# EAGLE design controller (EAGLE 9.5.0)

## Sheet 1 of 3
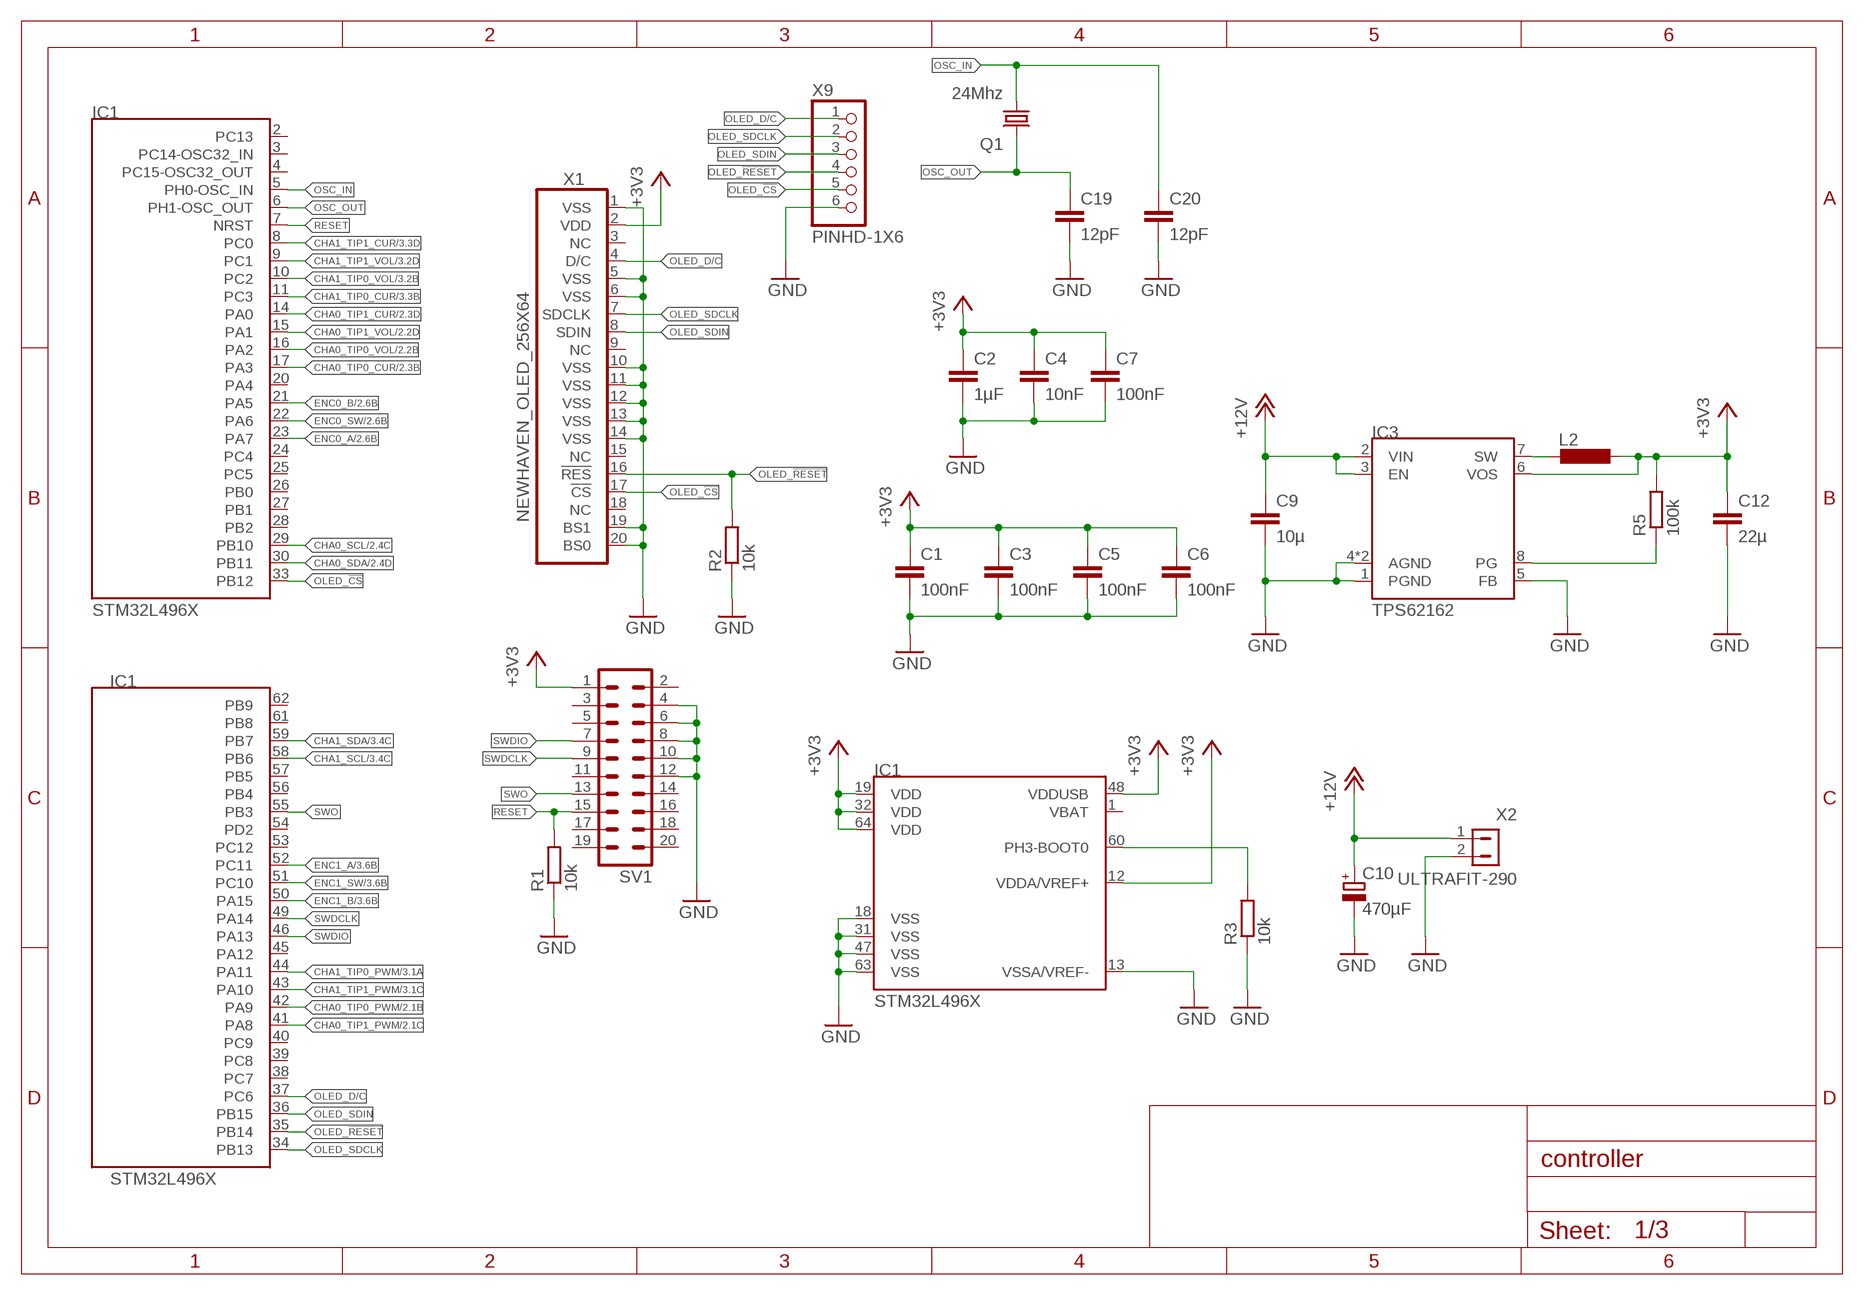
[diagram p0: schematic, sheet 1]

### Parts
C1  100nF  C-EUC0402  [C0402]
C2  1µF  C-EUC0402  [C0402]
C3  100nF  C-EUC0402  [C0402]
C4  10nF  C-EUC0402  [C0402]
C5  100nF  C-EUC0402  [C0402]
C6  100nF  C-EUC0402  [C0402]
C7  100nF  C-EUC0402  [C0402]
C9  10µ  C-EUC0805  [C0805]
C10  470µF  C-EEEFK  [C_EEEFK-10X10]
C12  22µ  C-EUC0805  [C0805]
C19  12pF  C-EUC0603  [C0603]
C20  12pF  C-EUC0603  [C0603]
IC1  STM32L496X  [TQFP64-10X10]
IC3  TPS62162  [WSON8]
L2  VLF3012S  [VLF3012ST]
Q1  24Mhz  XRCHA_F_A  [HCR2520]
R1  10k  R-EU_R0603  [R0603]
R2  10k  R-EU_R0603  [R0603]
R3  10k  R-EU_R0603  [R0603]
R5  100k  R-EU_R0603  [R0603]
SV1  ML20  [ML20]
X1  NEWHAVEN_OLED_256X64  [NEWHAVEN_OLED_256X64]
X2  ULTRAFIT-290  [ULTRAFIT-2-90]
X9  PINHD-1X6  [1X06]

### Nets
3V3_PG: IC3.8(PG) R5.1
3V3_SW: IC3.7(SW) L2.2
+3V3: C1.1 C2.1 C3.1 C4.1 C5.1 C6.1 C7.1 C12.1 IC1.12(VDDA/VREF+) IC1.19(VDD) IC1.32(VDD) IC1.48(VDDUSB) IC1.64(VDD) IC3.6(VOS) L2.1 R5.2 SV1.1 X1.2(VDD) ; also sheet 2,3
+12V: C9.1 C10.+ IC3.2(VIN) IC3.3(EN) X2.1 ; also sheet 2,3
BOOT0: IC1.60(PH3-BOOT0) R3.2
CHA0_SCL: IC1.29(PB10) ; also sheet 2
CHA0_SDA: IC1.30(PB11) ; also sheet 2
CHA0_TIP0_CUR: IC1.17(PA3) ; also sheet 2
CHA0_TIP0_PWM: IC1.42(PA9) ; also sheet 2
CHA0_TIP0_VOL: IC1.16(PA2) ; also sheet 2
CHA0_TIP1_CUR: IC1.14(PA0) ; also sheet 2
CHA0_TIP1_PWM: IC1.41(PA8) ; also sheet 2
CHA0_TIP1_VOL: IC1.15(PA1) ; also sheet 2
CHA1_SCL: IC1.58(PB6) ; also sheet 3
CHA1_SDA: IC1.59(PB7) ; also sheet 3
CHA1_TIP0_CUR: IC1.11(PC3) ; also sheet 3
CHA1_TIP0_PWM: IC1.44(PA11) ; also sheet 3
CHA1_TIP0_VOL: IC1.10(PC2) ; also sheet 3
CHA1_TIP1_CUR: IC1.8(PC0) ; also sheet 3
CHA1_TIP1_PWM: IC1.43(PA10) ; also sheet 3
CHA1_TIP1_VOL: IC1.9(PC1) ; also sheet 3
ENC0_A: IC1.23(PA7) ; also sheet 2
ENC0_B: IC1.21(PA5) ; also sheet 2
ENC0_SW: IC1.22(PA6) ; also sheet 2
ENC1_A: IC1.52(PC11) ; also sheet 3
ENC1_B: IC1.50(PA15) ; also sheet 3
ENC1_SW: IC1.51(PC10) ; also sheet 3
GND: C1.2 C2.2 C3.2 C4.2 C5.2 C6.2 C7.2 C9.2 C10.- C12.2 C19.2 C20.2 IC1.13(VSSA/VREF-) IC1.18(VSS) IC1.31(VSS) IC1.47(VSS) IC1.63(VSS) IC3.1(PGND) IC3.4(AGND) IC3.5(FB) IC3.GND(AGND) R1.1 R2.1 R3.1 SV1.4 SV1.6 SV1.8 SV1.10 SV1.12 X1.1(VSS) X1.5(VSS) X1.6(VSS) X1.10(VSS) X1.11(VSS) X1.12(VSS) X1.13(VSS) X1.14(VSS) X1.19(BS1) X1.20(BS0) X2.2 X9.6 ; also sheet 2,3
OLED_!CS: IC1.33(PB12) X1.17(!CS) X9.5
OLED_!RESET: IC1.35(PB14) R2.2 X1.16(!RES) X9.4
OLED_D/C: IC1.37(PC6) X1.4(D/C) X9.1
OLED_SDCLK: IC1.34(PB13) X1.7(SDCLK) X9.2
OLED_SDIN: IC1.36(PB15) X1.8(SDIN) X9.3
OSC_IN: C20.1 IC1.5(PH0-OSC_IN) Q1.1
OSC_OUT: C19.1 IC1.6(PH1-OSC_OUT) Q1.2
RESET: IC1.7(NRST) R1.2 SV1.15
SWDCLK: IC1.49(PA14) SV1.9
SWDIO: IC1.46(PA13) SV1.7
SWO: IC1.55(PB3) SV1.13
Unconnected: IC1.1(VBAT) IC1.2(PC13) IC1.3(PC14-OSC32_IN) IC1.4(PC15-OSC32_OUT) IC1.20(PA4) IC1.24(PC4) IC1.25(PC5) IC1.26(PB0) IC1.27(PB1) IC1.28(PB2) IC1.38(PC7) IC1.39(PC8) IC1.40(PC9) IC1.45(PA12) IC1.53(PC12) IC1.54(PD2) IC1.56(PB4) IC1.57(PB5) IC1.61(PB8) IC1.62(PB9) SV1.2 SV1.3 SV1.5 SV1.11 SV1.14 SV1.16 SV1.17 SV1.18 SV1.19 SV1.20 X1.3(NC) X1.9(NC) X1.15(NC) X1.18(NC)

## Sheet 2 of 3
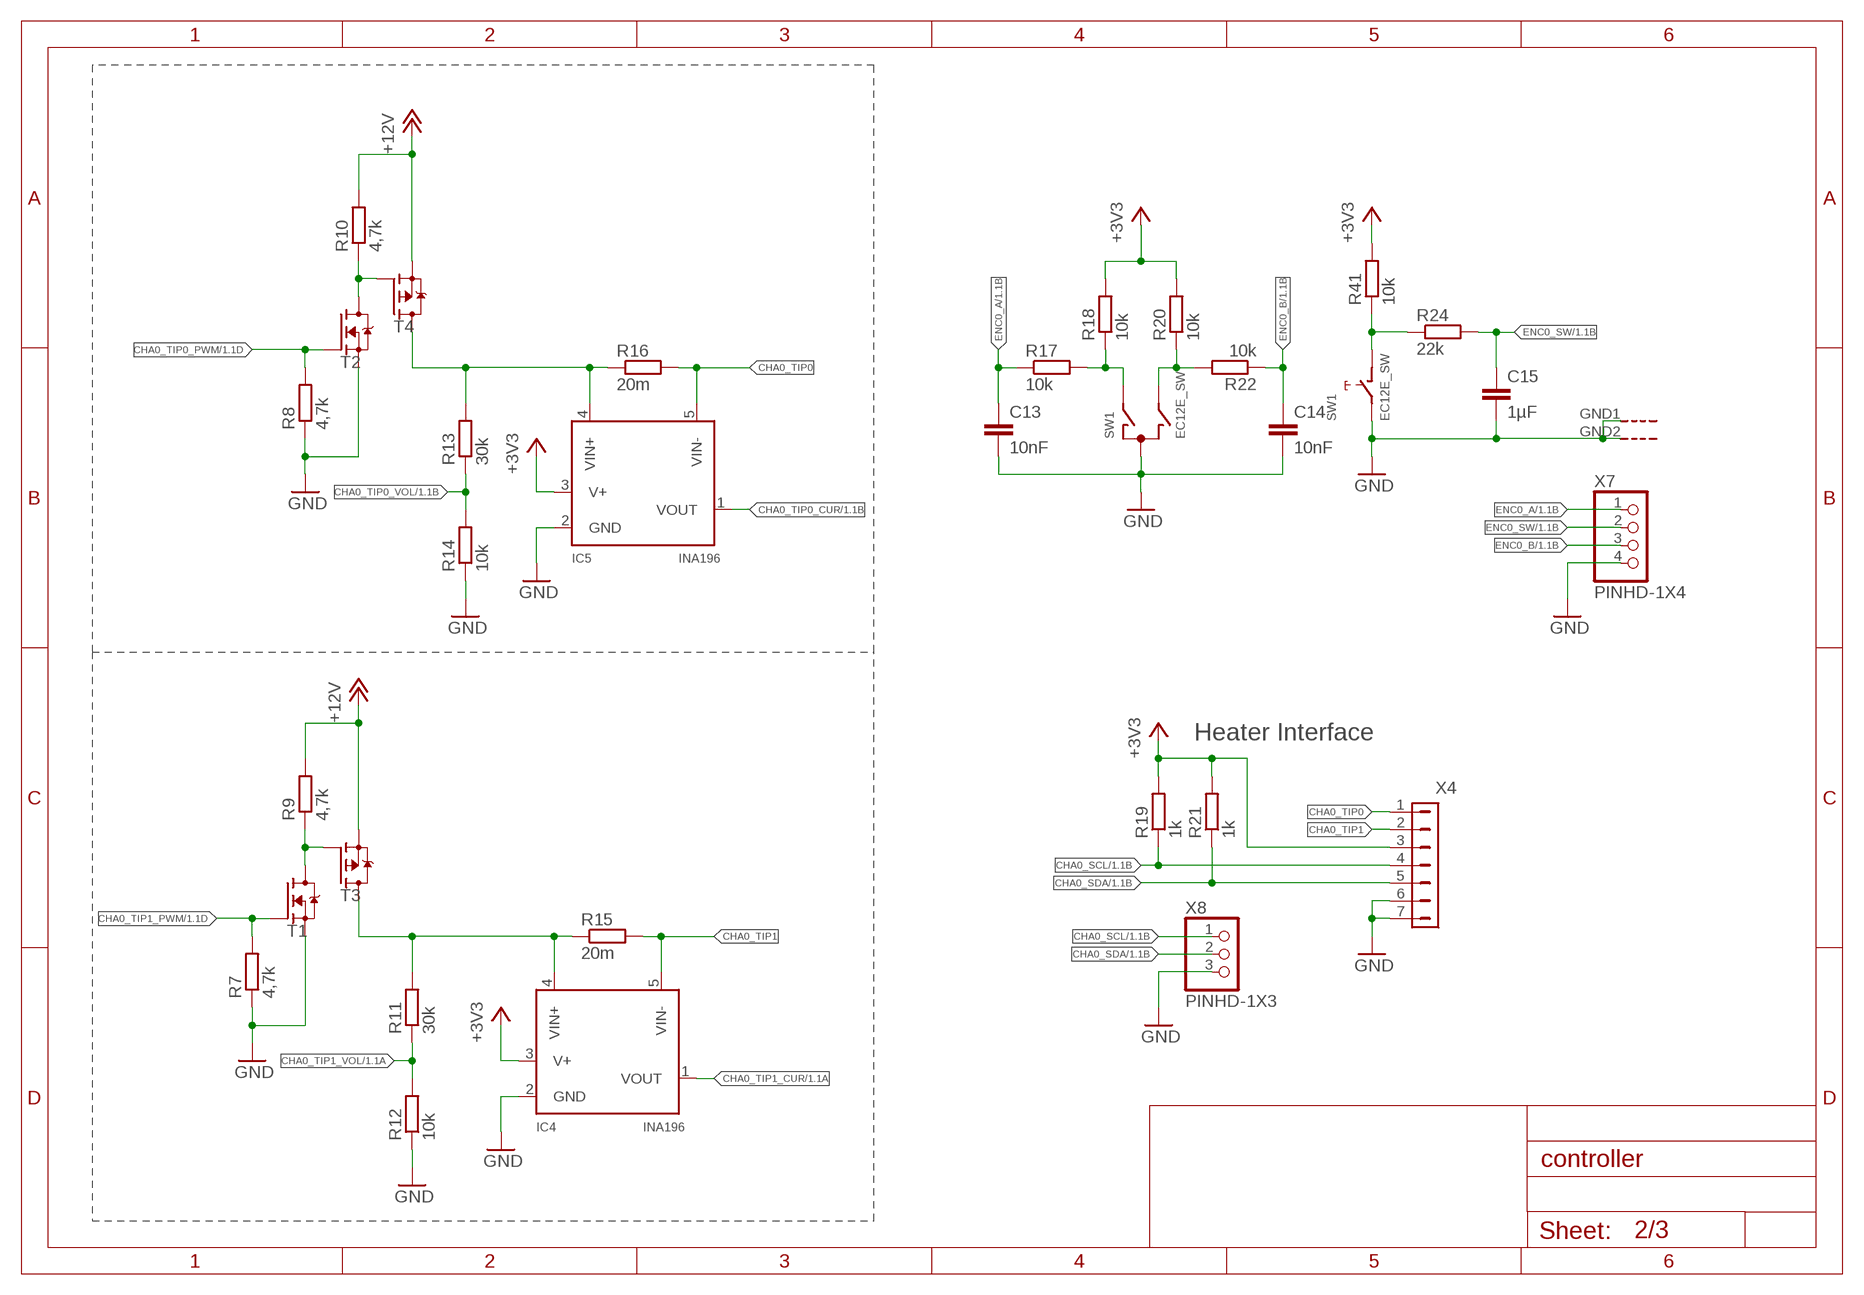
[diagram p1: schematic, sheet 2]

### Parts
C13  10nF  C-EUC0805  [C0805]
C14  10nF  C-EUC0805  [C0805]
C15  1µF  C-EUC0805  [C0805]
IC4  INA196  [SOT23-5L]
IC5  INA196  [SOT23-5L]
R7  4,7k  R-EU_R0805  [R0805]
R8  4,7k  R-EU_R0805  [R0805]
R9  4,7k  R-EU_R0805  [R0805]
R10  4,7k  R-EU_R0805  [R0805]
R11  30k  R-EU_R0603  [R0603]
R12  10k  R-EU_R0603  [R0603]
R13  30k  R-EU_R0603  [R0603]
R14  10k  R-EU_R0603  [R0603]
R15  20m  R-EU_R2010  [R2010]
R16  20m  R-EU_R2010  [R2010]
R17  10k  R-EU_R0805  [R0805]
R18  10k  R-EU_R0805  [R0805]
R19  1k  R-EU_R0603  [R0603]
R20  10k  R-EU_R0805  [R0805]
R21  1k  R-EU_R0603  [R0603]
R22  10k  R-EU_R0805  [R0805]
R24  22k  R-EU_R0805  [R0805]
R41  10k  R-EU_R0805  [R0805]
SW1  EC12E_SW  [ALPS_EC12E_SW]
T1  NVR4003NT3G  [SOT23]
T2  NVR4003NT3G  [SOT23]
T3  IRF7416  [SO8]
T4  IRF7416  [SO8]
X4  NANOFIT-7  [NANOFIT-7]
X7  PINHD-1X4  [1X04]
X8  PINHD-1X3  [1X03]

### Nets
+3V3: IC4.3(V+) IC5.3(V+) R18.2 R19.2 R20.2 R21.2 R41.2 X4.3 ; also sheet 1,3
+12V: R9.2 R10.2 T3.1(S) T3.2(S) T3.3(S) T4.1(S) T4.2(S) T4.3(S) ; also sheet 1,3
CHA0_SCL: R19.1 X4.4 X8.1 ; also sheet 1
CHA0_SDA: R21.1 X4.5 X8.2 ; also sheet 1
CHA0_TIP0: IC5.5(VIN-) R16.2 X4.1
CHA0_TIP0_CUR: IC5.1(VOUT) ; also sheet 1
CHA0_TIP0_PWM: R8.2 T2.1(G) ; also sheet 1
CHA0_TIP0_PWM_D: R10.1 T2.3(D) T4.4(G)
CHA0_TIP0_SEN: IC5.4(VIN+) R13.2 R16.1 T4.5(D) T4.6(D) T4.7(D) T4.8(D)
CHA0_TIP0_VOL: R13.1 R14.2 ; also sheet 1
CHA0_TIP1: IC4.5(VIN-) R15.2 X4.2
CHA0_TIP1_CUR: IC4.1(VOUT) ; also sheet 1
CHA0_TIP1_PWM: R7.2 T1.1(G) ; also sheet 1
CHA0_TIP1_PWM_D: R9.1 T1.3(D) T3.4(G)
CHA0_TIP1_SEN: IC4.4(VIN+) R11.2 R15.1 T3.5(D) T3.6(D) T3.7(D) T3.8(D)
CHA0_TIP1_VOL: R11.1 R12.2 ; also sheet 1
ENC0_A: C13.1 R17.1 X7.1 ; also sheet 1
ENC0_A_UNFIL: R17.2 R18.1 SW1.A
ENC0_B: C14.1 R22.1 X7.3 ; also sheet 1
ENC0_B_UNFIL: R20.1 R22.2 SW1.B
ENC0_SW: C15.1 R24.2 X7.2 ; also sheet 1
ENC0_SW_R: R24.1 R41.1 SW1.D
GND: C13.2 C14.2 C15.2 IC4.2(GND) IC5.2(GND) R7.1 R8.1 R12.1 R14.1 SW1.C SW1.E SW1.GND1(G) SW1.GND2(G) T1.2(S) T2.2(S) X4.6 X4.7 X7.4 X8.3 ; also sheet 1,3

### Notes on the sheet
- Heater Interface

## Sheet 3 of 3
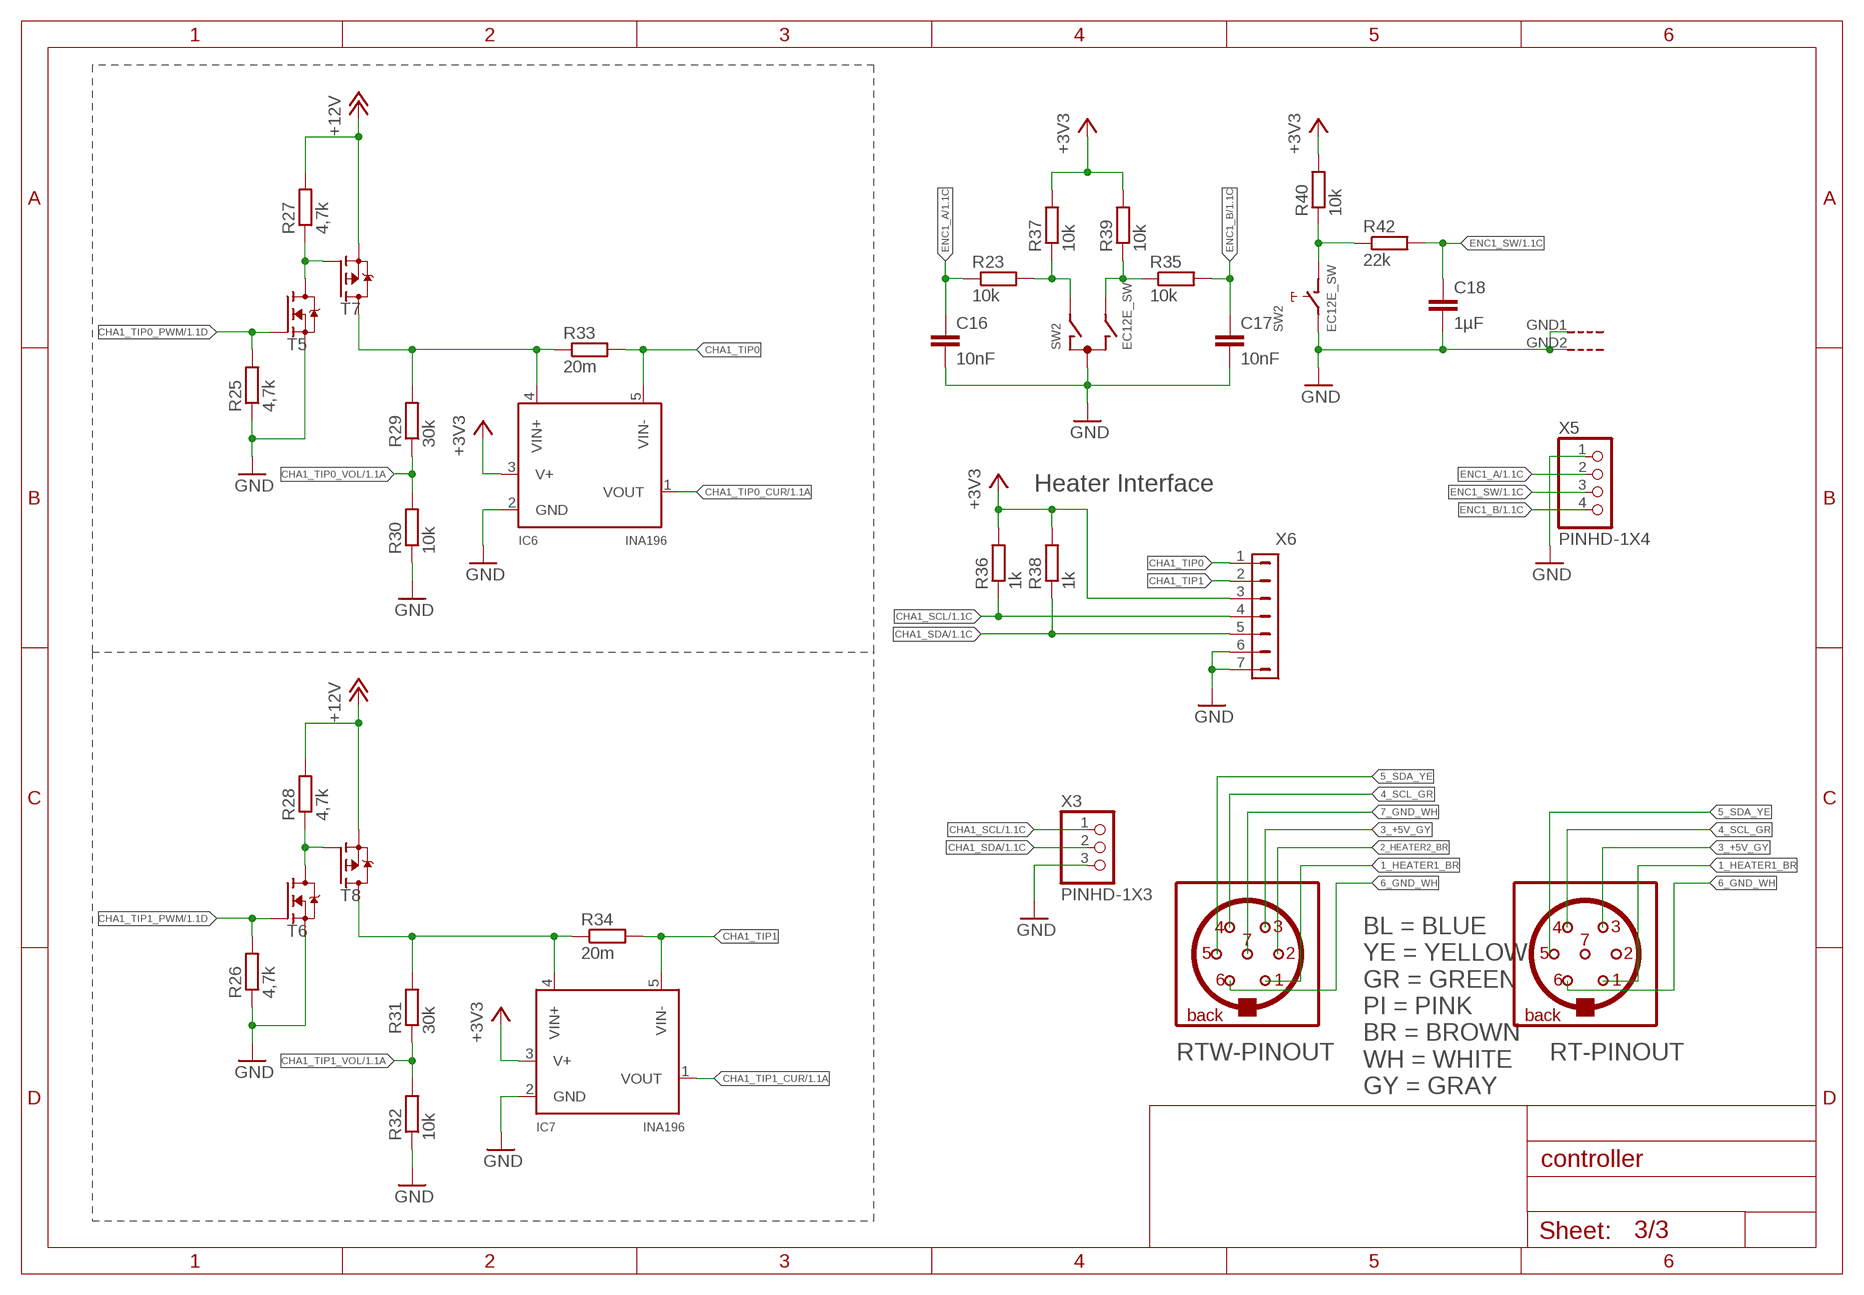
[diagram p2: schematic, sheet 3]

### Parts
C16  10nF  C-EUC0805  [C0805]
C17  10nF  C-EUC0805  [C0805]
C18  1µF  C-EUC0805  [C0805]
CON1  BINDER-IP40  (no package)
CON2  BINDER-IP40  (no package)
IC6  INA196  [SOT23-5L]
IC7  INA196  [SOT23-5L]
R23  10k  R-EU_R0805  [R0805]
R25  4,7k  R-EU_R0805  [R0805]
R26  4,7k  R-EU_R0805  [R0805]
R27  4,7k  R-EU_R0805  [R0805]
R28  4,7k  R-EU_R0805  [R0805]
R29  30k  R-EU_R0603  [R0603]
R30  10k  R-EU_R0603  [R0603]
R31  30k  R-EU_R0603  [R0603]
R32  10k  R-EU_R0603  [R0603]
R33  20m  R-EU_R2010  [R2010]
R34  20m  R-EU_R2010  [R2010]
R35  10k  R-EU_R0805  [R0805]
R36  1k  R-EU_R0603  [R0603]
R37  10k  R-EU_R0805  [R0805]
R38  1k  R-EU_R0603  [R0603]
R39  10k  R-EU_R0805  [R0805]
R40  10k  R-EU_R0805  [R0805]
R42  22k  R-EU_R0805  [R0805]
SW2  EC12E_SW  [ALPS_EC12E_SW]
T5  NVR4003NT3G  [SOT23]
T6  NVR4003NT3G  [SOT23]
T7  IRF7416  [SO8]
T8  IRF7416  [SO8]
X3  PINHD-1X3  [1X03]
X5  PINHD-1X4  [1X04]
X6  NANOFIT-7  [NANOFIT-7]

### Nets
1_HEATER1_BR: CON1.P$4 CON2.P$4
2_HEATER2_BR: CON1.P$2
3_+5V_GY: CON1.P$3 CON2.P$3
4_SCL_GR: CON1.P$6 CON2.P$6
5_SDA_YE: CON1.P$7
6_GND_WH: CON1.P$5 CON2.P$5
7_GND_WH: CON1.P$1
+3V3: IC6.3(V+) IC7.3(V+) R36.2 R37.2 R38.2 R39.2 R40.2 X6.3 ; also sheet 1,2
+12V: R27.2 R28.2 T7.1(S) T7.2(S) T7.3(S) T8.1(S) T8.2(S) T8.3(S) ; also sheet 1,2
CHA1_SCL: R36.1 X3.1 X6.4 ; also sheet 1
CHA1_SDA: R38.1 X3.2 X6.5 ; also sheet 1
CHA1_TIP0: IC6.5(VIN-) R33.2 X6.1
CHA1_TIP0_CUR: IC6.1(VOUT) ; also sheet 1
CHA1_TIP0_PWM: R25.2 T5.1(G) ; also sheet 1
CHA1_TIP0_PWM_D: R27.1 T5.3(D) T7.4(G)
CHA1_TIP0_SEN: IC6.4(VIN+) R29.2 R33.1 T7.5(D) T7.6(D) T7.7(D) T7.8(D)
CHA1_TIP0_VOL: R29.1 R30.2 ; also sheet 1
CHA1_TIP1: IC7.5(VIN-) R34.2 X6.2
CHA1_TIP1_CUR: IC7.1(VOUT) ; also sheet 1
CHA1_TIP1_PWM: R26.2 T6.1(G) ; also sheet 1
CHA1_TIP1_PWM_D: R28.1 T6.3(D) T8.4(G)
CHA1_TIP1_SEN: IC7.4(VIN+) R31.2 R34.1 T8.5(D) T8.6(D) T8.7(D) T8.8(D)
CHA1_TIP1_VOL: R31.1 R32.2 ; also sheet 1
ENC1_A: C16.1 R23.1 X5.2 ; also sheet 1
ENC1_A_UNFIL: R23.2 R37.1 SW2.A
ENC1_B: C17.1 R35.2 X5.4 ; also sheet 1
ENC1_B_UNFIL: R35.1 R39.1 SW2.B
ENC1_SW: C18.1 R42.2 X5.3 ; also sheet 1
ENC1_SW_R: R40.1 R42.1 SW2.D
GND: C16.2 C17.2 C18.2 IC6.2(GND) IC7.2(GND) R25.1 R26.1 R30.1 R32.1 SW2.C SW2.E SW2.GND1(G) SW2.GND2(G) T5.2(S) T6.2(S) X3.3 X5.1 X6.6 X6.7 ; also sheet 1,2
Unconnected: CON2.P$1 CON2.P$2 CON2.P$7

### Notes on the sheet
- Heater Interface
- BL = BLUE
  YE = YELLOW
  GR = GREEN
  PI = PINK
  BR = BROWN
  WH = WHITE
  GY = GRAY
- RTW-PINOUT | RT-PINOUT

## Library data of the parts
C1 C3 C5-C7 = rcl:C-EU: CAPACITOR, European symbol; OC_DIGIKEY: 1276-1001-1-ND; SPICEPREFIX: C
C2 = rcl:C-EU: CAPACITOR, European symbol; OC_DIGIKEY: 1276-1067-1-ND; SPICEPREFIX: C
C4 = rcl:C-EU: CAPACITOR, European symbol; OC_DIGIKEY: 311-1042-1-ND; SPICEPREFIX: C
C9 = rcl:C-EU: CAPACITOR, European symbol; OC_DIGIKEY: 1276-2890-1-ND; SPICEPREFIX: C
C10 = solderpi:C-EEEFK; OC_DIGIKEY: PCE3805CT-ND
C12 = rcl:C-EU: CAPACITOR, European symbol; OC_DIGIKEY: 1276-6526-1-ND; SPICEPREFIX: C
C13 C14 C16 C17 = rcl:C-EU: CAPACITOR, European symbol; OC_DIGIKEY: 732-8061-1-ND; SPICEPREFIX: C
C15 C18 = rcl:C-EU: CAPACITOR, European symbol; OC_DIGIKEY: 399-8008-1-ND; SPICEPREFIX: C
C19 C20 = rcl:C-EU: CAPACITOR, European symbol; OC_DIGIKEY: 478-11444-1-ND; SPICEPREFIX: C
CON1 CON2 = solderpi:BINDER-IP40
IC1 = solderpi:STM32L496X; OC_DIGIKEY: 497-17173-ND
IC3 = solderpi:TPS62162; OC_DIGIKEY: 296-29897-1-ND
IC4-IC7 = solderpi:INA196; OC_DIGIKEY: 296-17166-1-ND
L2 = solderpi:VLF3012S; OC_DIGIKEY: 445-4200-1-ND
Q1 = solderpi:XRCHA_F_A; OC_DIGIKEY: 490-9652-1-ND
R1-R3 R12 R14 R30 R32 = rcl:R-EU_: RESISTOR, European symbol; OC_DIGIKEY: RMCF0603FT10K0CT-ND; SPICEPREFIX: R
R5 = rcl:R-EU_: RESISTOR, European symbol; OC_DIGIKEY: RMCF0603FT100KCT-ND; SPICEPREFIX: R
R7-R10 R25-R28 = rcl:R-EU_: RESISTOR, European symbol; OC_DIGIKEY: CR0805-FX-4701GLFTR-ND; SPICEPREFIX: R
R11 R13 R29 R31 = rcl:R-EU_: RESISTOR, European symbol; OC_DIGIKEY: RMCF0603FT30K0CT-ND; SPICEPREFIX: R
R15 R16 R33 R34 = rcl:R-EU_: RESISTOR, European symbol; OC_DIGIKEY: 541-10266-1-ND; SPICEPREFIX: R
R17 R18 R20 R22 R23 R35 R37 R39-R41 = rcl:R-EU_: RESISTOR, European symbol; OC_DIGIKEY: 311-10.0KCRCT-ND; SPICEPREFIX: R
R19 R21 R36 R38 = rcl:R-EU_: RESISTOR, European symbol; OC_DIGIKEY: RMCF0603FT1K00CT-ND; SPICEPREFIX: R
R24 R42 = rcl:R-EU_: RESISTOR, European symbol; OC_DIGIKEY: 311-22.0KCRCT-ND; SPICEPREFIX: R
SV1 = solderpi:ML20: HARTING; OC_DIGIKEY: S9172-ND; OC_FARNELL: unknown; OC_NEWARK: unknown
SW1 SW2 = switch-alps:EC12E_SW: ALPS rotary Encoder EC12E series with switch; MPN: EC12E2424407; OC_FARNELL: 1520813; OC_NEWARK: 74M1068
T1 T2 T5 T6 = solderpi:NVR4003NT3G; OC_DIGIKEY: NVR4003NT3GOSCT-ND
T3 T4 T7 T8 = solderpi:IRF7416; OC_DIGIKEY: IRF7416TRPBFCT-ND
X1 = solderpi:NEWHAVEN_OLED_256X64: PIN HEADER; OC_DIGIKEY: SAM1093-20-ND
X2 = solderpi:ULTRAFIT-2; OC_DIGIKEY: WM11586-ND
X3 X8 = solderpi:PINHD-1X3: PIN HEADER; OC_DIGIKEY: 1849-1003-ND
X4 X6 = solderpi:NANOFIT-7; OC_DIGIKEY: WM16898-ND
X5 X7 = solderpi:PINHD-1X4: PIN HEADER; OC_DIGIKEY: 2057-PH1-04-UA-ND
X9 = solderpi:PINHD-1X6: PIN HEADER; OC_DIGIKEY: 1849-1001-ND

## Net classes
0 default: width 0.2 mm, drill 0.3 mm, clearance 0.2 mm

## Board
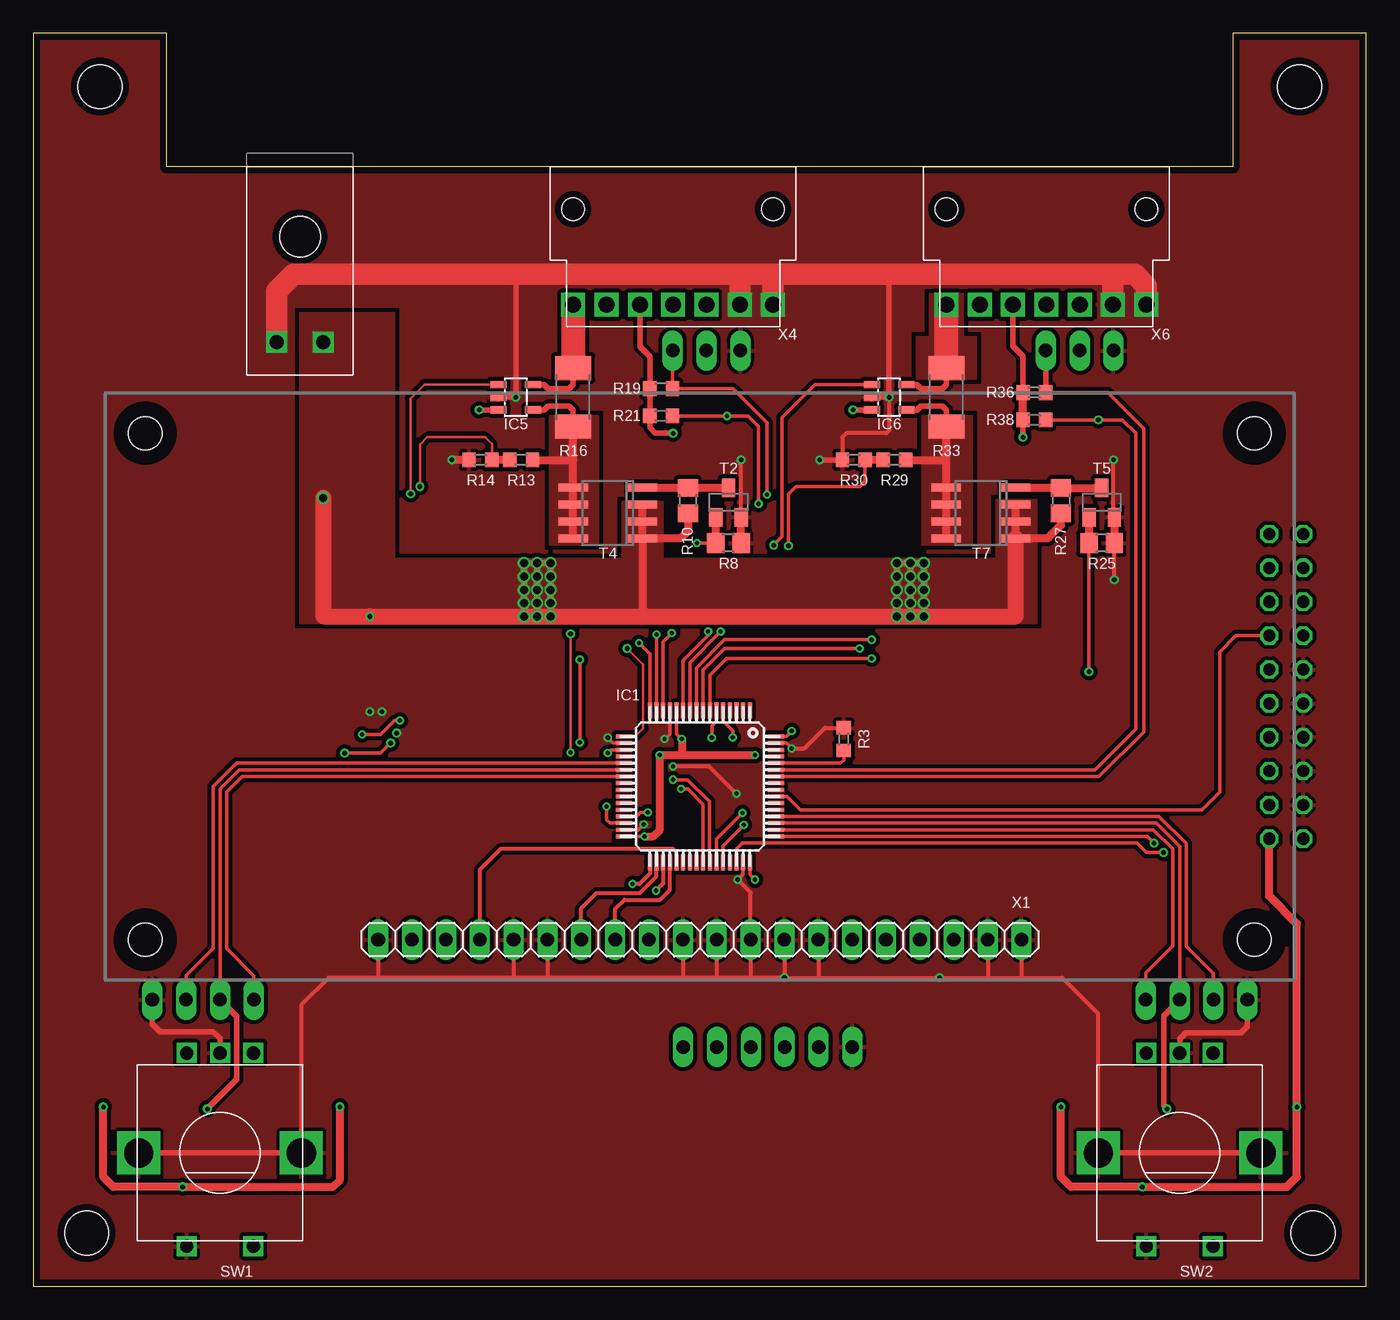
[diagram p3: board, top side]
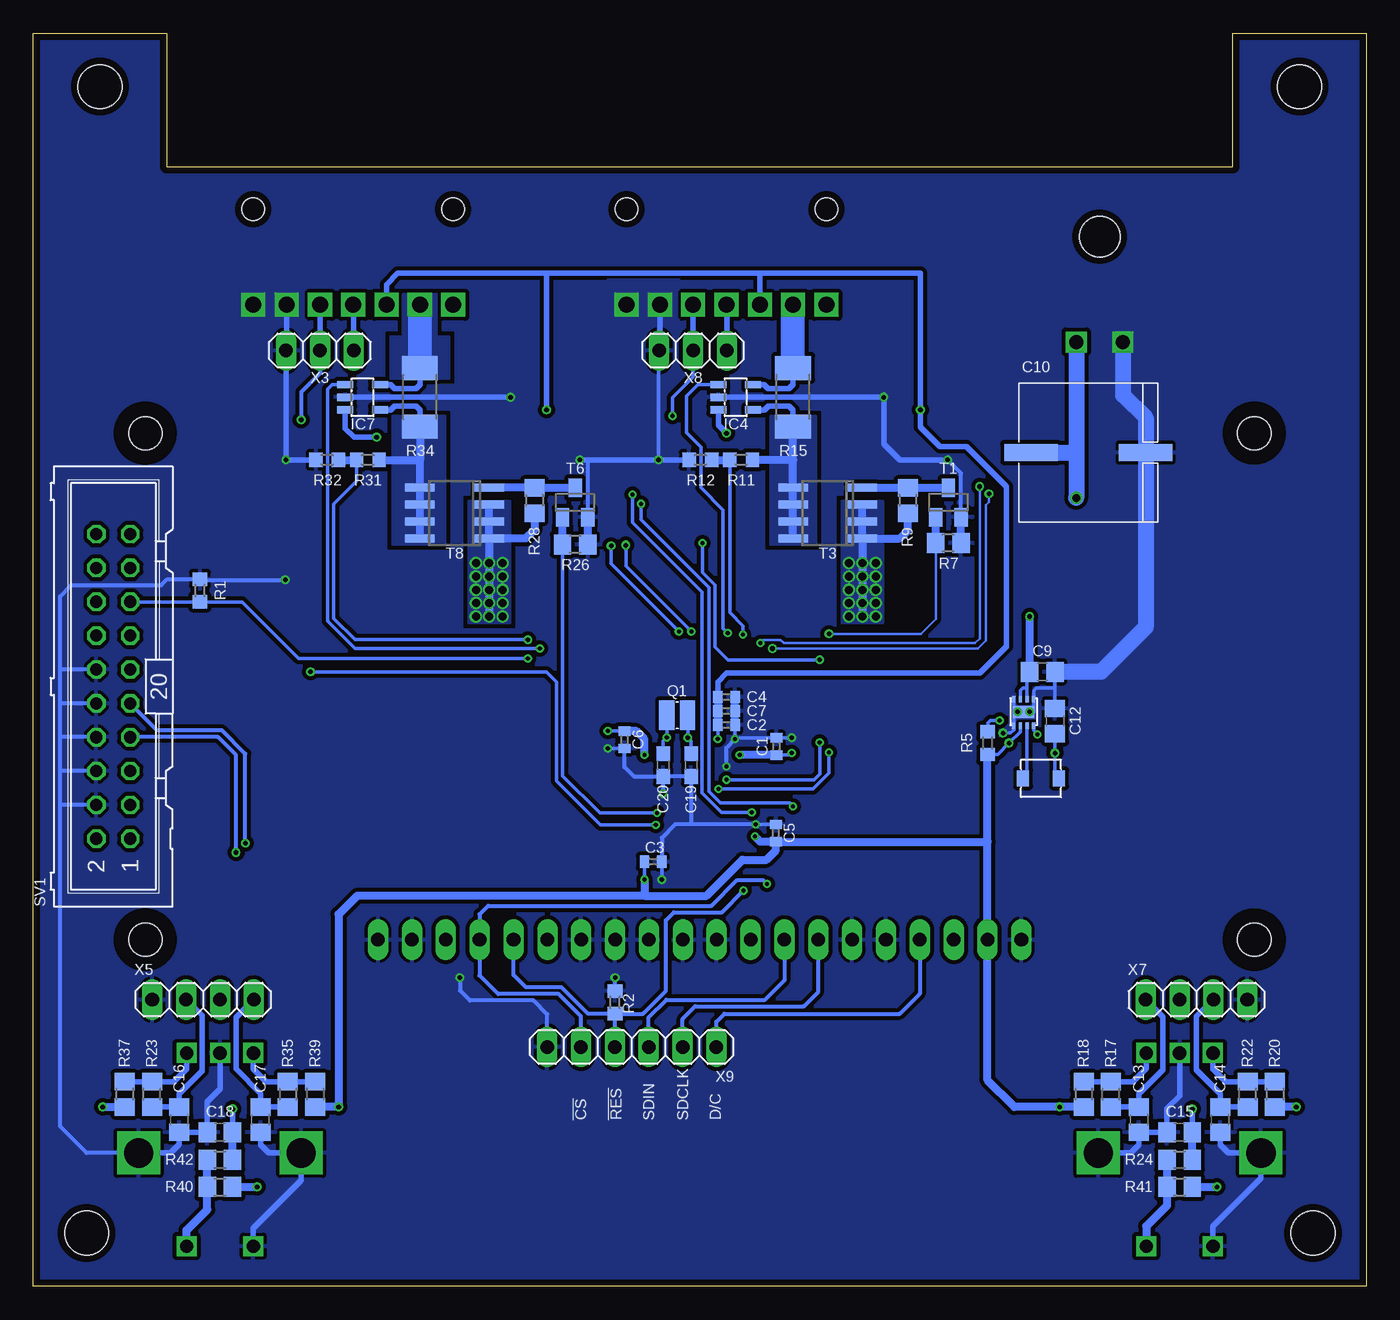
[diagram p4: board, bottom side, seen from below]

Size 100 x 94 mm. Coordinates in mm from the lower left corner, seen from the top.
Outline: 0,0 100,0 100,94 90,94 90,84 10,84 10,94 0,94 0,0
Copper layers (1*16): Top 0.035mm / dielectric 1.6mm / Bottom 0.035mm
Design rules "Elecrow_2-layer_PCB_eagle_rule": minimum track width 6mil, minimum drill 12mil, track to track 6mil, track to pad 6mil, pad to pad 6mil, via to via 8mil, smd to smd 0mil, copper to edge 20mil, drill to drill 10mil, minimum pad ring 6mil, minimum via ring 6mil, stop-mask expansion 0mil, vias tented up to drill 100mil, thermal gap 10mil
Holes 3.3 mm at 4,4 96,4 95,90 5,90

### Footprints (pad centres in the part's own frame; a part is rotated, then mirrored left to right if it is on the bottom)
C0402 = smd 0.7 x 0.9: 1 -0.65,0; 2 0.65,0
C0805 = smd 1.3 x 1.5: 1 -0.95,0; 2 0.95,0
C_EEEFK-10X10 = smd 4 x 1.3: + -4.3,0; - 4.3,0
C0603 = smd 1.1 x 1: 1 -0.85,0; 2 0.85,0
TQFP64-10X10 = smd 1.2 x 0.3: 1 -5.7,3.75; 2 -5.7,3.25; 3 -5.7,2.75; 4 -5.7,2.25; 5 -5.7,1.75; 6 -5.7,1.25; 7 -5.7,0.75; 8 -5.7,0.25; 9 -5.7,-0.25; 10 -5.7,-0.75; 11 -5.7,-1.25; 12 -5.7,-1.75; 13 -5.7,-2.25; 14 -5.7,-2.75; 15 -5.7,-3.25; 16 -5.7,-3.75; 33 5.7,-3.75; 34 5.7,-3.25; 35 5.7,-2.75; 36 5.7,-2.25; 37 5.7,-1.75; 38 5.7,-1.25; 39 5.7,-0.75; 40 5.7,-0.25; 41 5.7,0.25; 42 5.7,0.75; 43 5.7,1.25; 44 5.7,1.75; 45 5.7,2.25; 46 5.7,2.75; 47 5.7,3.25; 48 5.7,3.75 | smd 0.3 x 1.2: 17 -3.75,-5.7; 18 -3.25,-5.7; 19 -2.75,-5.7; 20 -2.25,-5.7; 21 -1.75,-5.7; 22 -1.25,-5.7; 23 -0.75,-5.7; 24 -0.25,-5.7; 25 0.25,-5.7; 26 0.75,-5.7; 27 1.25,-5.7; 28 1.75,-5.7; 29 2.25,-5.7; 30 2.75,-5.7; 31 3.25,-5.7; 32 3.75,-5.7; 49 3.75,5.7; 50 3.25,5.7; 51 2.75,5.7; 52 2.25,5.7; 53 1.75,5.7; 54 1.25,5.7; 55 0.75,5.7; 56 0.25,5.7; 57 -0.25,5.7; 58 -0.75,5.7; 59 -1.25,5.7; 60 -1.75,5.7; 61 -2.25,5.7; 62 -2.75,5.7; 63 -3.25,5.7; 64 -3.75,5.7
WSON8 = smd 0.5 x 0.25: 1 -0.95,0.75; 2 -0.95,0.25; 3 -0.95,-0.25; 4 -0.95,-0.75; 5 1.05,-0.75; 6 1.05,-0.25; 7 1.05,0.25; 8 1.05,0.75 | smd 0.9 x 1.6: GND 0,0
SOT23-5L = smd 0.55 x 1.2: 1 -0.95,-1.3; 2 0,-1.3; 3 0.95,-1.3; 4 0.95,1.3; 5 -0.95,1.3
VLF3012ST = smd 0.9 x 1.2: 1 -1.35,0; 2 1.35,0
HCR2520 = smd 1.15 x 2.2: 1 -0.775,0; 2 0.775,0
R0603 = smd 1 x 1.1: 1 -0.85,0; 2 0.85,0
R0805 = smd 1.3 x 1.5: 1 -0.95,0; 2 0.95,0
R2010 = smd 1.8 x 2.7: 1 -2.2,0; 2 2.2,0
ML20 = drill 0.914 octagon: 1 -11.43,-1.27; 2 -11.43,1.27; 3 -8.89,-1.27; 4 -8.89,1.27; 5 -6.35,-1.27; 6 -6.35,1.27; 7 -3.81,-1.27; 8 -3.81,1.27; 9 -1.27,-1.27; 10 -1.27,1.27; 11 1.27,-1.27; 12 1.27,1.27; 13 3.81,-1.27; 14 3.81,1.27; 15 6.35,-1.27; 16 6.35,1.27; 17 8.89,-1.27; 18 8.89,1.27; 19 11.43,-1.27; 20 11.43,1.27
ALPS_EC12E_SW = drill 1 square: A -2.5,-7.5; B 2.5,-7.5; C 0,-7.5; D -2.5,7; E 2.5,7 | drill 2.2 square: GND1 -6.1,0; GND2 6.1,0
SOT23 = smd 1 x 1.4: 1 -0.95,-1.1; 2 0.95,-1.1; 3 0,1.1
SO8 = smd 0.6 x 2.2: 1 -1.905,-2.6; 2 -0.635,-2.6; 3 0.635,-2.6; 4 1.905,-2.6; 5 1.905,2.6; 6 0.635,2.6; 7 -0.635,2.6; 8 -1.905,2.6
NEWHAVEN_OLED_256X64 = drill 1.016 long: 1 24.13,19; 2 21.59,19; 3 19.05,19; 4 16.51,19; 5 13.97,19; 6 11.43,19; 7 8.89,19; 8 6.35,19; 9 3.81,19; 10 1.27,19; 11 -1.27,19; 12 -3.81,19; 13 -6.35,19; 14 -8.89,19; 15 -11.43,19; 16 -13.97,19; 17 -16.52,19; 18 -19.06,19; 19 -21.6,19; 20 -24.14,19 | hole 2.5: -41.6,-19; 41.6,-19; -41.6,19; 41.6,19
ULTRAFIT-2-90 = drill 1.05 square: 1 -1.75,13.16; 2 1.75,13.15 | hole 3.05: 0,5.25
1X03 = drill 1.016 long: 1 -2.54,0; 2 0,0; 3 2.54,0
NANOFIT-7 = drill 1.2 square: 1 7.5,10.37; 2 5,10.37; 3 2.5,10.37; 4 0,10.37; 5 -2.5,10.37; 6 -5,10.37; 7 -7.5,10.37 | hole 1.7: -7.5,3.2; 7.5,3.2
1X04 = drill 1.016 long: 1 -3.81,0; 2 -1.27,0; 3 1.27,0; 4 3.81,0
1X06 = drill 1.016 long: 1 -6.35,0; 2 -3.81,0; 3 -1.27,0; 4 1.27,0; 5 3.81,0; 6 6.35,0

### Placement (x,y rotation side)
C1  44.25,40.5 90 bottom
C2  48,42.1 0 bottom
C3  53.5,31.85 0 bottom
C4  48,44.2 0 bottom
C5  44.3,34 90 bottom
C6  55.65,41 270 bottom
C7  48,43.15 0 bottom
C9  24.3,46.1 0 bottom
C10  20.85,62.55 0 bottom
C12  23.35,42.4 90 bottom
C13  17.05,12.5 270 bottom
C14  10.95,12.5 270 bottom
C15  14,11.55 180 bottom
C16  89.05,12.5 270 bottom
C17  82.95,12.5 270 bottom
C18  86,11.55 180 bottom
C19  50.65,39.1 270 bottom
C20  52.75,39.1 270 bottom
IC1  50,37.5 270 top
IC3  25.7,43.1 270 bottom
IC4  47.3,66.7 270 bottom
IC5  36.2,66.7 270 top
IC6  64.2,66.7 270 top
IC7  75.3,66.7 270 bottom
L2  24.4,38.1 180 bottom
Q1  51.7,42.85 0 bottom
R1  87.5,52.2 270 bottom
R2  56.36,21.3 270 bottom
R3  60.8,41.05 270 top
R5  28.4,40.75 270 bottom
R7  31.35,55.75 180 bottom
R8  52.15,55.75 180 top
R9  34.4,58.95 270 bottom
R10  49.1,58.95 270 top
R11  46.9,62 0 bottom
R12  49.95,62 0 bottom
R13  36.6,62 0 top
R14  33.55,62 0 top
R15  43,66.7 90 bottom
R16  40.5,66.7 90 top
R17  19.15,14.4 90 bottom
R18  21.2,14.4 270 bottom
R19  47.1,67.35 180 top
R20  6.85,14.4 270 bottom
R21  47.1,65.3 180 top
R22  8.9,14.4 90 bottom
R23  91.1,14.4 90 bottom
R24  14,9.5 0 bottom
R25  80.15,55.75 180 top
R26  59.35,55.65 180 bottom
R27  77.1,58.95 270 top
R28  62.4,58.95 270 bottom
R29  64.6,62 0 top
R30  61.55,62 0 top
R31  74.9,62 0 bottom
R32  77.95,62 0 bottom
R33  68.5,66.7 90 top
R34  71,66.7 90 bottom
R35  80.9,14.4 270 bottom
R36  75.1,67.05 180 top
R37  93.15,14.4 270 bottom
R38  75.1,65 180 top
R39  78.85,14.4 270 bottom
R40  86,7.45 0 bottom
R41  14,7.45 0 bottom
R42  86,9.5 0 bottom
SV1  94,45 90 bottom
SW1  14,10 180 top
SW2  86,10 180 top
T1  31.35,58.8 0 bottom
T2  52.15,58.8 0 top
T3  40.4,58 90 bottom
T4  43.1,58 90 top
T5  80.15,58.8 0 top
T6  59.35,58.8 0 bottom
T7  71.1,58 90 top
T8  68.4,58 90 bottom
X1  50,45 180 top
X2  20,84 180 top
X3  78.5,70.2 180 bottom
X4  48,84 180 top
X5  87.27,21.5 0 bottom
X6  76,84 180 top
X7  12.73,21.5 0 bottom
X8  50.5,70.2 180 bottom
X9  55.1,17.95 180 bottom

### Tracks (layer width: path | path; a pad name or v marks a point on that pad's centre or on a via)
3V3_PG  (via drill 0.3)
  Top 0.25: v27.5,42.45 27.1,42.45 26.05,41.4 v24.66,41.4
  Bottom 0.25: R5.1 28.4,42.25 28.2,42.45 v27.5,42.45 | IC3.8 24.95,41.69 v24.66,41.4
3V3_SW
  Bottom 0.2: L2.2 25.45,38.4
  Bottom 0.25: 25.45,38.4 IC3.7
+3V3  (via drill 0.3, 0.35)
  Top 0.25: v26.8,40.75 26.05,40 v23.35,40 | IC1.48 53.75,30.9 v54.15,30.5 | IC1.64 56.5,41.25 v56.9,41.65 | IC1.19 43.35,40.25 v43.1,40 | v45.85,33.75 IC1.32 | IC1.12 48.25,41.45 v48.65,41.05
  Top 0.4: IC5.3 v33.45,65.75 | X4.3 45.5,70.5 46.25,69.75 R19.2 R21.2 46.25,64.4 46.65,64 v48,64 | R36.2 74.25,69.8 73.5,70.55 X6.3 | IC6.3 v61.5,65.75 | R38.2 v74.25,63.7
  Top 0.6: v5.25,13.45 5.25,8.2 6,7.45 v11.2,7.45 22.45,7.45 23,8 v23,13.45 | v77.1,13.45 77.1,8.2 77.85,7.45 v83.2,7.45 94.05,7.45 94.8,8.2 v94.8,13.45 94.8,27.2 92.73,29.27 SV1.1 | v45.85,33.75 46.5,33.75 47,34.25 v47,39.85 48.65,39.85 | 48.65,39.85 v54.15,39.85 | v48.65,41.05 48.65,39.85 | R38.2 R36.2
  Bottom 0.25: IC3.6 25.95,41.6 v26.8,40.75 27.65,39.9 R5.2 | C12.1 v23.35,40 23.35,38.1 L2.1 | v54.15,30.5 C3.1 | v56.9,41.65 C6.1 | v43.1,40 43.25,39.85 C1.1 | v48.65,41.05 C2.1
  Bottom 0.4: R5.2 | X4.3 45.5,76 | 45.5,76 33.45,76 v33.45,65.75 33.45,64.45 32,63 30,63 27,60 27,48 29,46 48,46 48.65,45.35 C4.1 | 45.5,76 61.5,76 | 61.5,76 72.65,76 73.5,75.15 X6.3 | IC4.3 48.6,64.6 v48,64 | v61.5,65.75 61.5,76 | v74.25,63.7 75.95,63.7 76.6,64.35 IC7.3
  Bottom 0.6: R18.2 v23,13.45 26.4,13.45 28.41,15.46 X1.2 28.41,33.35 | R41.2 v11.2,7.45 | v5.25,13.45 R20.2 | R40.2 v83.2,7.45 | R39.2 v77.1,13.45 77.1,27.9 75.7,29.3 54.15,29.3 | v94.8,13.45 R37.2 | R5.2 28.42,39.9 R5.2 28.41,33.35 | C6.1 54.75,41.65 54.15,41.05 v54.15,39.85 | C5.1 28.41,33.35 | C5.1 45.45,33.35 v45.85,33.75 | 54.15,29.3 49.5,29.3 46.8,32 45,32 44.3,32.7 C5.1 | v54.15,30.5 54.15,29.3 | C1.1 v47,39.85 | C4.1 C7.1 C2.1
+12V  (via drill 0.35, 0.6)
  Top 0.5: v37.8,50.25 v37.8,51.25 v37.8,52.25 v37.8,53.25 v37.8,54.25 | 39,50.25 v38.8,50.25 v38.8,51.25 v38.8,52.25 v38.8,53.25 v38.8,54.25 v37.8,54.25 | v37.8,54.25 v36.8,54.25 v36.8,53.25 v36.8,52.25 v36.8,51.25 v36.8,50.25 | 65,50.25 v64.8,50.25 v64.8,51.25 v64.8,52.25 v64.8,53.25 v64.8,54.25 v65.8,54.25 | 67,50.25 v66.8,50.25 v66.8,51.25 v66.8,52.25 v66.8,53.25 v66.8,54.25 v65.8,54.25 | v65.8,54.25 v65.8,53.25 v65.8,52.25 v65.8,51.25 v65.8,50.25
  Top 0.6: R10.2 49.1,56.65 48.55,56.09 T4.1 | R27.2 77.1,57.1 76.09,56.09 T7.1 T7.2 T7.3 | T4.1 T4.2 T4.3 | T4.1 45.7,50.25 46,50.25
  Top 1.2: v21.75,59.15 21.75,50.25 v25.25,50.25 v37.8,50.25 39,50.25 46,50.25 65,50.25 v65.8,50.25 67,50.25 73.7,50.25 T7.1
  Bottom 0.25: IC3.2 25.45,44.9 | 25.45,44.9 25.45,45.95 C9.1 | IC3.3 25.95,44.7 25.75,44.9 25.45,44.9
  Bottom 0.6: R28.2 62.4,56.75 63.05,56.09 T8.1 | T3.1 35.01,56.09 34.4,56.7 R9.2 | T3.1 T3.2 T3.3 | T3.1 v37.8,50.25 | T8.1 T8.2 T8.3 | T8.1 v65.8,50.25 | C9.1 v25.25,50.25
  Bottom 1.2: X2.1 21.75,62.55 | 21.75,62.55 v21.75,59.15 | C10.+ 21.75,62.55
  pour Bottom (no thermals): 36.25,58.9 39.35,58.9 39.35,49.75 36.25,49.75
  pour Bottom (no thermals): 64.25,58.9 67.35,58.9 67.35,49.75 64.25,49.75
  pour Top (isolate 0.305, no thermals): 20,73 20,49.75 75.25,49.75 75.25,59 72.25,59 72.25,54.55 47.2,54.55 47.2,58.85 44.2,58.85 44.2,54.55 27.05,54.55 27.05,73
BOOT0
  Top 0.25: IC1.60 60.55,39.25 60.8,39.5 R3.2
CHA0_SCL  (via drill 0.3)
  Top 0.25: X8.1 R19.1 52.5,67.35 55.05,64.8 v55.05,59.4 | IC1.29 45.26,35.25 45.56,35.55 v46.1,35.55
  Bottom 0.25: v46.1,35.55 48.38,35.55 49.83,37 49.83,52.08 55.05,57.3 v55.05,59.4
  Bottom 0.4: X8.1 47.96,73.63 X4.4
CHA0_SDA  (via drill 0.3)
  Top 0.25: R21.1 v52.05,65.3 53.6,65.3 54.42,64.48 v54.42,58.7 | IC1.30 43.25,34.75 43,35 v43,36
  Bottom 0.25: v43,36 43.25,36.25 48.44,36.25 49.33,37.13 49.33,52.42 54.42,57.52 v54.42,58.7 | v52.05,65.3 52.05,66.65 50.5,68.2 X8.2
  Bottom 0.4: X8.2 X4.5
CHA0_TIP0
  Top 0.4: IC5.5 38,67.65 38.3,67.65 38.6,67.35 40.2,67.35 40.5,67.65 R16.2
  Top 1.8: X4.1 R16.2
CHA0_TIP0_CUR  (via drill 0.35)
  Top 0.2: IC1.17 45.15,41.25 45.75,41.85 45.75,46.65 v44.55,47.85 | IC5.1 29.35,67.65 28.3,66.6 v28.3,59.45
  Bottom 0.2: v44.55,47.85 29.13,47.85 28.55,48.43 28.55,58.6 28.3,58.85 v28.3,59.45
CHA0_TIP0_PWM  (via drill 0.3)
  Top 0.25: IC1.42 50.73,31.82 50.73,36.36 49.09,38 v48,38 | R8.2 v49.8,55.75 | v41,40.8 v41,47
  Top 0.6: R8.2 T2.1
  Bottom 0.25: v48,38 41.45,38 41,38.45 v41,40.8 | v49.8,55.75 49.8,53.54 48.88,52.61 48.88,47.98 47.9,47 v41,47
CHA0_TIP0_PWM_D
  Top 0.6: T2.3 R10.1 T4.4
CHA0_TIP0_SEN
  Top 0.4: IC5.4 38.3,65.75 38.6,66.05 39,66.05 40.2,66.05 40.5,65.75 R16.1
  Top 0.6: R13.2 40.5,62 | T4.8 T4.7 T4.6 T4.5 40.5,62 | 40.5,62 R16.1
  pour Top (isolate 0.305, no thermals): 38.75,65.3 38.75,55.65 42.35,55.65 42.35,65.3
CHA0_TIP0_VOL  (via drill 0.3, 0.35)
  Top 0.2: R14.2 34.4,63.2 33.9,63.7 29.55,63.7 29,63.15 v29,60
  Top 0.25: IC1.16 46.25,47.45 v45.45,48.25
  Top 0.6: R13.1 R14.2
  Bottom 0.2: v45.45,48.25 45.22,48.48 43.93,48.48 43.7,48.25 29.35,48.25 29,48.6 v29,60
CHA0_TIP1
  Bottom 0.4: R15.2 43,67.65 43.3,67.35 44.9,67.35 45.2,67.65 IC4.5
  Bottom 1.8: R15.2 X4.2
CHA0_TIP1_CUR  (via drill 0.3)
  Top 0.25: IC1.14 47.25,48.35 v47.9,49
  Bottom 0.25: v47.9,49 48.25,49.35 48.25,58.25 49.92,59.92 49.92,62.98 51,64.05 51,66.8 50.15,67.65 IC4.1
CHA0_TIP1_PWM  (via drill 0.3, 0.35)
  Top 0.2: v40.3,40.05 v40.3,48.95
  Top 0.25: IC1.41 50.25,36.15 49.1,37.3 v48.6,37.3
  Bottom 0.2: v40.3,48.95 33.4,48.95 32.3,50.05 R7.2
  Bottom 0.25: v48.6,37.3 41.5,37.3 40.3,38.5 v40.3,40.05
  Bottom 0.6: R7.2 T1.1
CHA0_TIP1_PWM_D
  Bottom 0.6: T1.3 R9.1 T3.4
CHA0_TIP1_SEN
  Bottom 0.4: IC4.4 45.15,65.75 44.85,66.05 43.3,66.05 43,65.75 R15.1
  Bottom 0.6: 43,62 R11.2 | T3.8 T3.7 T3.6 T3.5 43,62 | 43,62 R15.1
  pour Bottom (isolate 0.305, no thermals): 44.7,65.3 44.7,55.65 41.3,55.65 41.3,65.3
CHA0_TIP1_VOL  (via drill 0.3)
  Top 0.25: IC1.15 v46.75,48.9
  Bottom 0.25: v46.75,48.9 46.75,49.55 47.75,50.55 R11.1
  Bottom 0.6: R12.2 R11.1
CHA1_SCL
  Top 0.25: IC1.58 79.96,38.25 83.31,41.6 83.31,64.35 80.61,67.05 R36.1
  Top 0.4: R36.1 X3.1
  Bottom 0.4: X3.1 75.96,73.63 X6.4
CHA1_SDA  (via drill 0.35)
  Top 0.25: IC1.59 79.65,38.75 82.7,41.8 82.7,64 81.7,65 v79.9,65 R38.1
  Bottom 0.3: X3.2 78.5,68.5 79.9,67.1 v79.9,65
  Bottom 0.4: X3.2 X6.5
CHA1_TIP0
  Top 0.4: IC6.5 66.3,67.65 66.6,67.35 68.2,67.35 68.5,67.65 R33.2
  Top 1.8: R33.2 X6.1
  pour Top (no thermals): 69.75,74.45 67.25,74.45 67.25,71.2 66.3,71.2 66.3,68.1 70.7,68.1 70.7,71.2 69.75,71.2
CHA1_TIP0_CUR  (via drill 0.3, 0.35)
  Top 0.25: IC6.1 58.65,67.65 56.15,65.15 56.15,56.25 55.55,55.65 v55.55,55.6 | v50.63,49.12 50.63,48.83 48.75,46.95 IC1.11
  Bottom 0.25: v55.55,55.6 55.55,54.03 v50.63,49.12
CHA1_TIP0_PWM  (via drill 0.3, 0.35)
  Top 0.25: IC1.44 51.75,33.05 v53.3,34.6 | v79.2,46.1 R25.2
  Top 0.6: T5.1 R25.2
  Bottom 0.25: v53.3,34.6 57.45,34.6 60.75,37.9 60.75,45.35 61.5,46.1 v79.2,46.1
CHA1_TIP0_PWM_D
  Top 0.6: T7.4 R27.1 T5.3
CHA1_TIP0_SEN
  Top 0.4: IC6.4 66.3,65.75 66.6,66.05 68.2,66.05 68.5,65.75 R33.1
  Top 0.6: T7.8 T7.7 T7.6 T7.5 68.5,62 | 68.5,62 R33.1 | R29.2 68.5,62
  pour Top (no thermals): 66.7,65.3 70.4,65.3 70.4,55.65 66.7,55.65
CHA1_TIP0_VOL  (via drill 0.3, 0.35)
  Top 0.25: R30.2 62.4,60.4 62,60 57.2,60 56.65,59.45 v56.65,55.55 | IC1.10 49.25,46.81 v51.57,49.13
  Top 0.6: R29.1 R30.2
  Bottom 0.25: v51.57,49.13 56.65,54.21 v56.65,55.55
CHA1_TIP1
  Bottom 0.4: IC7.5 73.2,67.65 72.9,67.35 71.3,67.35 71,67.65 R34.2
  Bottom 1.8: R34.2 X6.2
  pour Bottom (no thermals): 69.75,74.45 72.25,74.45 72.25,71.25 73.2,71.25 73.2,68.1 68.8,68.1 68.8,71.25 69.75,71.25
CHA1_TIP1_CUR  (via drill 0.3)
  Top 0.25: v62,47.85 51.85,47.85 50.25,46.25 IC1.8
  Bottom 0.25: IC7.1 77.6,67.65 77.92,67.33 77.92,49.92 75.85,47.85 v62,47.85
CHA1_TIP1_PWM  (via drill 0.3)
  Top 0.25: IC1.43 51.25,33.55 v53.2,35.5
  Bottom 0.25: v53.2,35.5 57.5,35.5 60.3,38.3 R26.2
  Bottom 0.6: R26.2 T6.1
CHA1_TIP1_PWM_D
  Bottom 0.6: T6.3 R28.1 T8.4
CHA1_TIP1_SEN
  Bottom 0.4: IC7.4 73.2,65.75 72.9,66.05 71.3,66.05 71,65.75 R34.1
  Bottom 0.6: T8.8 T8.7 T8.6 T8.5 71,62 | R31.2 71,62 | R34.1 71,62
  pour Bottom (no thermals): 69.1,65.3 69.1,55.65 73.05,55.65 73.05,65.3
CHA1_TIP1_VOL  (via drill 0.3)
  Top 0.25: IC1.9 49.75,46.39 51.87,48.5 v62.9,48.5
  Bottom 0.25: R31.1 75.75,60.4 77.47,58.67 77.47,50.11 75.87,48.5 v62.9,48.5
  Bottom 0.6: R32.2 R31.1
ENC0_A
  Top 0.25: X7.1 16.54,23.3 14.5,25.34 14.5,37.09 15.66,38.25 IC1.23
  Bottom 0.4: X7.1 15.25,20.21 15.25,16.25 17.05,14.45 C13.1 R17.1
ENC0_A_UNFIL
  Bottom 0.4: SW1.A 16.5,16.35 17.5,15.35 R17.2 R18.1
ENC0_B
  Top 0.25: X7.3 11.46,23.31 13.5,25.35 13.5,37.5 15.25,39.25 IC1.21
  Bottom 0.4: X7.3 12.73,20.23 12.73,16.23 10.95,14.45 C14.1 R22.1
ENC0_B_UNFIL
  Bottom 0.4: SW1.B 11.5,16.3 10.55,15.35 R22.2 R20.1
ENC0_SW  (via drill 0.35)
  Top 0.25: X7.2 14,37.29 15.46,38.75 IC1.22
  Top 0.4: v13.05,13.3 15.27,15.52 15.27,20.23 X7.2
  Bottom 0.4: C15.1 v13.05,13.3
  Bottom 0.6: R24.2 C15.1
ENC0_SW_R
  Bottom 0.6: SW1.D 16.5,4.5 14.95,6.05 R41.1 R24.1
ENC1_A
  Top 0.25: X5.2 88.54,23.46 86.5,25.5 86.5,33.21 84.46,35.25 IC1.52
  Bottom 0.4: R23.1 C16.1 89.05,14.45 87.35,16.15 87.35,20.31 X5.2
ENC1_A_UNFIL
  Bottom 0.4: R37.1 R23.2 89.45,15.35 88.5,16.3 SW2.A
ENC1_B
  Top 0.25: X5.4 83.46,23.51 85.5,25.55 85.5,32.79 84.04,34.25 IC1.50
  Bottom 0.4: R35.2 C17.1 82.95,14.45 84.8,16.3 84.8,20.16 X5.4
ENC1_B_UNFIL
  Bottom 0.4: R39.1 R35.1 82.55,15.35 83.5,16.3 SW2.B
ENC1_SW  (via drill 0.35)
  Top 0.25: X5.3 86,33 84.25,34.75 IC1.51
  Top 0.4: v85.05,13.3 84.8,13.55 84.8,20.3 X5.3
  Bottom 0.4: C18.1 v85.05,13.3
  Bottom 0.6: R42.2 C18.1
ENC1_SW_R
  Bottom 0.6: SW2.D 88.5,4.2 86.95,5.75 R40.1 R42.1
GND  (via drill 0.3, 0.35)
  Top 0.25: IC1.47 53.25,30.9 v52.85,30.5 | IC1.63 56.5,40.75 v56.9,40.35 | IC1.18 43.5,40.75 v43.1,41.15 | IC1.31 45.4,34.25 v45.8,34.65 | IC1.13 47.75,41.45 v47.35,41.05
  Top 0.3: SW2.GND2 79.9,20.45 77.2,23.15 74.14,23.15 | 71.6,23.15 74.14,23.15 | X1.20 74.14,23.15 | X1.19 71.6,23.15 | v56.35,23.15 53.81,23.15 | 53.81,23.15 51.27,23.15 | 51.27,23.15 48.73,23.15 | 48.73,23.15 38.57,23.15 | 38.57,23.15 36.03,23.15 | X1.5 36.03,23.15 | X1.6 38.57,23.15 | X1.10 48.73,23.15 | X1.11 51.27,23.15 | 53.81,23.15 X1.12 53.81,29.54 v52.85,30.5 | X1.13 v56.35,23.15 | v56.35,23.15 58.89,23.15 | X1.14 58.89,23.15 | 58.89,23.15 v68,23.15 71.6,23.15 | SW1.GND1 20.1,21.1 22.15,23.15 25.87,23.15 | 36.03,23.15 25.87,23.15 | X1.1 25.87,23.15 | T5.2 81.04,57.76 v81.04,62.01 | T2.2 v53.1,62 | v81.1,53 R25.1 | v56.9,40.35 57.85,40.35 59.4,41.9 R3.1 | v52.75,36.95 50.7,39 v48,39 | v64.2,66.7 64.2,64.2 64,64 61,64 60.7,63.7 R30.1
  Top 0.4: SW1.GND2 SW1.GND1 | SW2.GND1 SW2.GND2 | SW1.C 14,18.6 13.5,19.1 9.5,19.1 8.92,19.68 X7.4 | SW2.C 86,18.55 86.45,19 90.6,19 91.08,19.48 X5.1 | v59,62 R30.1 | v81.04,62.01 v81.05,62 | IC5.2 v36.2,66.7 36.2,75.92 37,75.92 | IC6.2 v64.2,66.7 64.2,75.92 65,75.92
  Top 0.6: T5.2 R25.1 | R8.1 T2.2 | R14.1 v31.4,62
  Top 1.6: X6.7 83.5,75.05 82.63,75.92 81,75.92 | 53,75.92 37,75.92 19.52,75.92 18.25,74.65 X2.2 | 53,75.92 55.5,75.92 | 55.5,75.92 65,75.92 81,75.92 | X6.6 81,75.92 | X4.7 55.5,75.92 | X4.6 53,75.92
  Bottom 0.25: C9.2 23.35,44.9 | 23.35,44.9 C12.2 | 23.35,44.9 24.75,44.9 24.95,44.7 IC3.1 24.95,43.1 IC3.GND 26.45,43.1 | v27.25,41.5 26.69,41.5 26.45,41.74 IC3.5 26.45,43.1 | v52.85,30.5 C3.2 | v56.9,40.35 C6.2 | v43.1,41.15 C1.2 47.25,41.15 v47.35,41.05 C2.2 | v45.8,34.65 C5.2 | X8.3 53.1,70.14 v53.1,62 | IC3.4 26.45,43.1
  Bottom 0.3: v68,23.15 68,22.19 67.24,21.43 62.48,21.43 61.45,20.4 X9.6 | SW2.GND1 96,10 98,12 98,36.11 | 98,36.11 98,38.65 | 98,38.65 98,41.19 | 98,41.19 98,43.73 | SV1.10 98,43.73 | SV1.8 98,41.19 | SV1.6 98,38.65 | SV1.4 98,36.11 | R2.1 v56.36,23.15 v56.35,23.15 | T1.2 30.4,61 v31.4,62 | T6.2 58.4,62 58,62 | 98,46.27 98,51.75 97.15,52.6 90.4,52.6 89.95,53.05 R1.1 87.45,53 v81.1,53 | SV1.12 98,46.27 | 98,43.73 98,46.27 | C20.2 54.95,38.25 55.65,38.95 C6.2 | C20.2 C19.2 50.65,34.65 | C3.2 52.85,33.65 51.85,34.65 50.65,34.65 | v45.8,34.65 50.65,34.65 | C20.2 v52.75,36.95 | v47.35,41.05 48,40.4 v48,39
  Bottom 0.4: SW1.C 14,14.3 14.95,13.35 C15.2 C13.2 17.05,10.6 17.65,10 SW1.GND1 | SW1.E 11.5,4.5 7.9,8.1 SW1.GND2 10.35,10 10.95,10.6 C14.2 | C17.2 82.95,10.6 82.35,10 SW2.GND2 79.9,7.95 83.5,4.35 SW2.E | SW2.GND1 89.7,10 89.05,10.65 C16.2 C18.2 86.95,13.85 86,14.8 SW2.C | R12.1 v53.1,62 58,62 v59,62 | R32.1 v81.05,62 X3.3 81,70.2 X6.6 | IC4.2 v36.2,66.7 36.2,63.2 35,62 v31.4,62 | IC7.2 v64.2,66.7 | X8.3 53,70.2 X4.6
  Bottom 0.6: R26.1 T6.2 | R7.1 T1.2 | C2.2 C7.2 C4.2
  Bottom 1.2: X2.2 18.25,66.85 16.55,65.15 C10.- 16.55,49.45 19.9,46.1 C9.2
  other vias: 25.25,43.1 26.15,43.1
  pour Top (no thermals): 51.75,76 51.75,72.05 56.9,72.05 56.9,76
  pour Top (no thermals): 79.9,75.2 79.9,72 84.7,72 84.7,75.2
  pour Bottom (no thermals): 84.9,76 84.9,72 79.55,72 79.55,76
  pour Bottom (no thermals): 56.9,76 56.9,72.05 51.55,72.05 51.55,76
  pour Bottom (isolate 0.305, rank 2): 100,0 0,0 0,94 10,94 10,84 90,84 90,94 100,94
  pour Top (isolate 0.305, rank 2): 0,94 0,0 100,0 100,94 90,94 90,84 10,84 10,94
  pour Bottom (no thermals): 26.75,44.45 24.5,44.45 24.5,41.75 26.75,41.75
  pour Top (no thermals): 17,73 19.45,73 19.45,69.4 17,69.4
  pour Bottom (no thermals): 19.45,73 17,73 17,69.4 19.45,69.4
OLED_!CS  (via drill 0.3)
  Top 0.3: IC1.33 46.25,30.96 45.47,30.18 v44.95,30.18
  Bottom 0.3: X9.5 58.91,20.26 60.58,21.93 65.13,21.93 66.52,23.32 X1.17 66.52,27.9 65.87,28.55 49.13,28.55 47.2,30.48 45.25,30.48 v44.95,30.18
OLED_!RESET  (via drill 0.3)
  Top 0.3: IC1.35 47.25,30.21 v46.72,29.68
  Bottom 0.3: X9.4 R2.2 | R2.2 58.39,20.45 60.37,22.43 63.05,22.43 63.97,23.35 X1.16 | R2.2 54.26,20.45 52.55,22.16 52.55,27.45 51.95,28.05 48.35,28.05 v46.72,29.68
OLED_D/C
  Top 0.3: X1.4 33.49,31.24 35.05,32.8 47.99,32.8 48.25,32.55 IC1.37
  Bottom 0.3: X1.4 33.49,21.95 34.99,20.45 48.15,20.45 48.75,19.85 X9.1
OLED_SDCLK
  Top 0.3: X1.7 41.11,28.36 42.25,29.5 45.5,29.5 46.75,30.75 IC1.34
  Bottom 0.3: X1.7 41.11,22.09 42.2,21 50.34,21 51.29,20.05 X9.2
OLED_SDIN
  Top 0.3: X1.8 43.65,28.3 44.35,29 47,29 47.75,29.75 IC1.36
  Bottom 0.3: X1.8 43.65,22.95 45.1,21.5 52.5,21.5 53.83,20.17 X9.3
OSC_IN  (via drill 0.3)
  Top 0.25: IC1.5 51.75,42.4 52.48,41.67 v52.48,41.17
  Bottom 0.25: Q1.1 v52.48,41.17 52.75,40.9 C20.1
OSC_OUT  (via drill 0.3)
  Top 0.25: IC1.6 51.25,42.4 50.9,42.05 v50.9,41.15
  Bottom 0.25: Q1.2 50.9,42.83 v50.9,41.15 50.65,40.9 C19.1
RESET  (via drill 0.3)
  Top 0.25: v62.9,47.1 52,47.1 50.75,45.85 IC1.7
  Bottom 0.25: SV1.15 R1.2 84.35,51.35 80.1,47.1 v62.9,47.1
SWDCLK  (via drill 0.35)
  Top 0.25: v84.09,33.24 83.58,33.75 IC1.49
  Bottom 0.3: v84.09,33.24 84.09,39.94 85.88,41.73 90.73,41.73 SV1.9
SWDIO  (via drill 0.35)
  Top 0.25: v84.79,32.54 83.51,32.54 82.8,33.25 53.2,33.25 52.75,32.8 IC1.46
  Bottom 0.3: v84.79,32.54 84.79,39.84 86.14,41.19 SV1.7
SWO
  Top 0.25: IC1.55 56.55,36.75 57.55,35.75 87.65,35.75 89,37.1 89,47.58 90.23,48.81 SV1.13

### Text on the board
bNames: D/C | SDCLK | SDIN | !RES | !CS